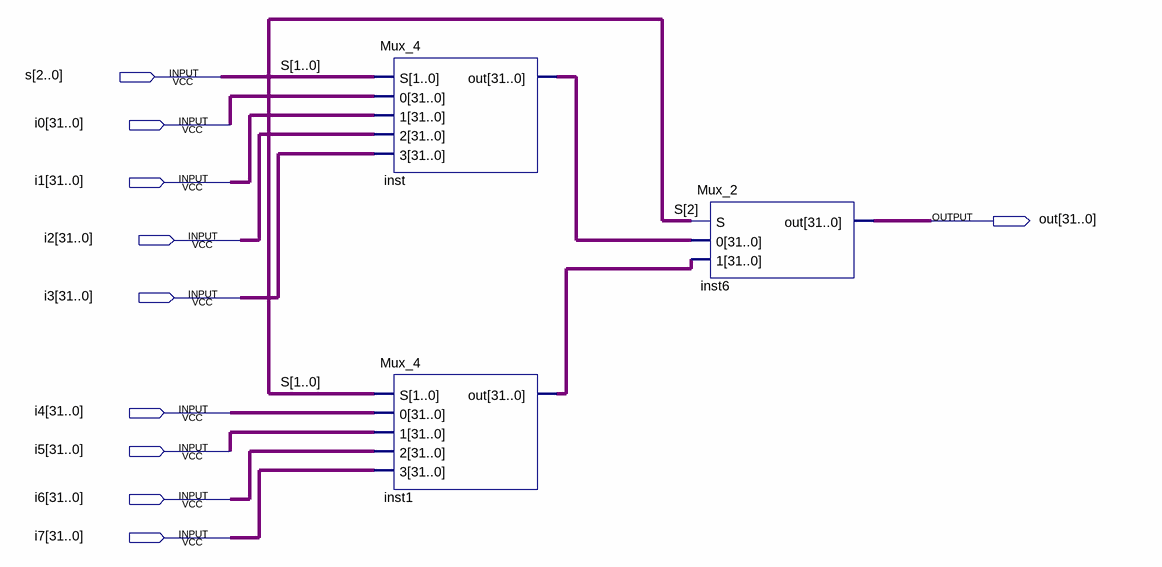
[diagram p0: schematic sheet]
// Quartus schematic Mux_8.bdf as structural Verilog: 3 symbols, 10 pins
module Mux_8 (
  input  [2:0] s,
  input  [31:0] i0,
  input  [31:0] i1,
  input  [31:0] i2,
  input  [31:0] i3,
  input  [31:0] i4,
  input  [31:0] i5,
  input  [31:0] i6,
  input  [31:0] i7,
  output [31:0] out
);

  wire [31:0] inst1_out, inst_out;

  Mux_4 inst (.S(s[1:0]), .\0 (i0), .\1 (i1), .\2 (i2), .\3 (i3), .out(inst_out));
  Mux_4 inst1 (.S(s[1:0]), .\0 (i4), .\1 (i5), .\2 (i6), .\3 (i7), .out(inst1_out));
  Mux_2 inst6 (.S(s[2]), .\0 (inst_out), .\1 (inst1_out), .out(out));
endmodule
